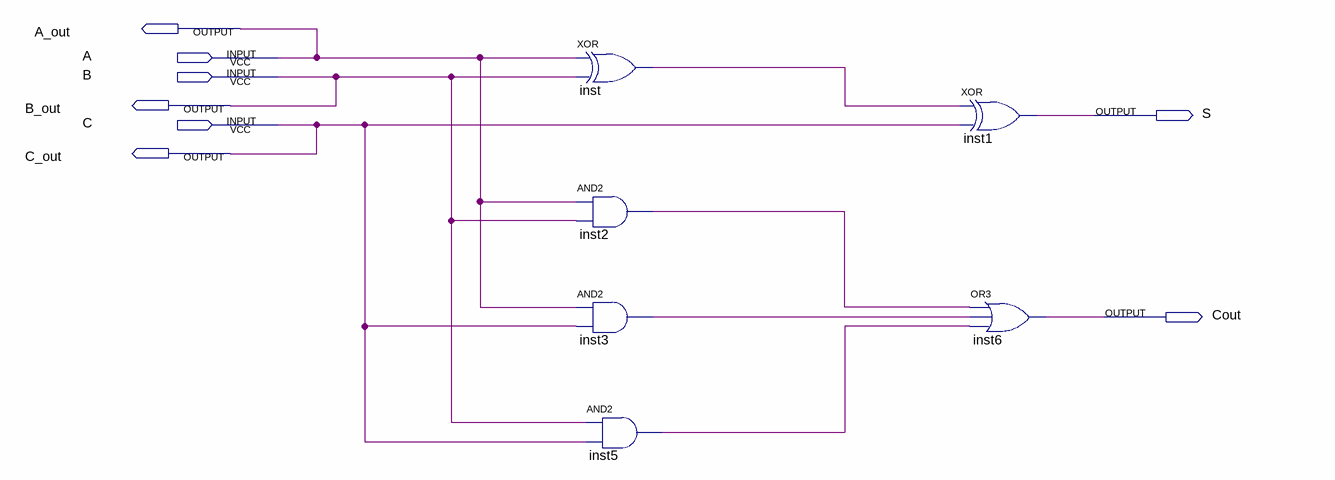
[diagram p0: schematic sheet]
// Quartus schematic FullAdder.bdf as structural Verilog: 6 symbols, 8 pins
module FullAdder (
  input  A,
  input  B,
  input  C,
  output A_out,
  output B_out,
  output S,
  output C_out,
  output Cout
);

  wire inst2_out, inst3_out, inst5_out, inst_out;

  xor inst (inst_out, A, B);
  and inst2 (inst2_out, A, B);
  and inst3 (inst3_out, A, C);
  and inst5 (inst5_out, B, C);
  xor inst1 (S, inst_out, C);
  or inst6 (Cout, inst2_out, inst3_out, inst5_out);

  assign A_out = A;
  assign B_out = B;
  assign C_out = C;
endmodule
